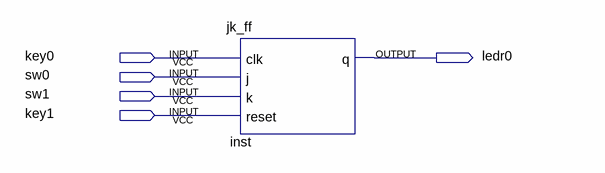
[diagram p0: schematic sheet]
// Quartus schematic jk_ff_tb.bdf as structural Verilog: 1 symbols, 5 pins
module jk_ff_tb (
  input  key0,
  input  sw0,
  input  sw1,
  input  key1,
  output ledr0
);

  jk_ff inst (.clk(key0), .j(sw0), .k(sw1), .reset(key1), .q(ledr0));
endmodule
